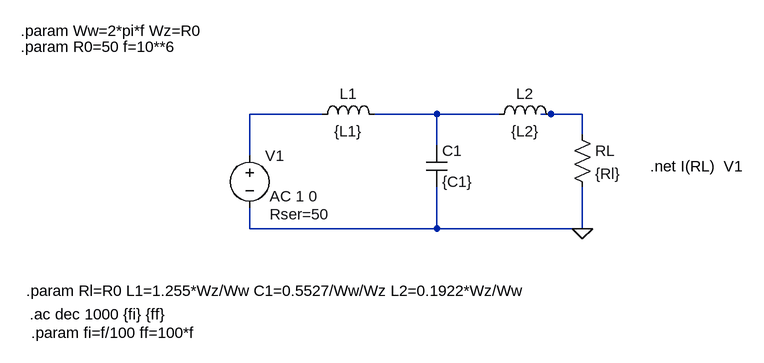
[diagram p0: schematic TS13.asc]
TS13.asc, the LTspice schematic file:
Version 4
SHEET 1 880 680
WIRE 176 96 64 96
WIRE 352 96 256 96
WIRE 448 96 352 96
WIRE 528 96 512 96
WIRE 576 96 528 96
WIRE 576 128 576 96
WIRE 352 144 352 96
WIRE 64 160 64 96
WIRE 64 272 64 240
WIRE 352 272 352 208
WIRE 352 272 64 272
WIRE 576 272 576 208
WIRE 576 272 352 272
FLAG 576 272 0
SYMBOL ind 160 112 R270
WINDOW 0 32 56 VTop 2
WINDOW 3 5 56 VBottom 2
SYMATTR InstName L1
SYMATTR Value {L1}
SYMBOL ind 432 112 R270
WINDOW 0 32 56 VTop 2
WINDOW 3 5 56 VBottom 2
SYMATTR InstName L2
SYMATTR Value {L2}
SYMBOL cap 336 144 R0
SYMATTR InstName C1
SYMATTR Value {C1}
SYMBOL res 560 112 R0
SYMATTR InstName RL
SYMATTR Value {Rl}
SYMBOL voltage 64 144 R0
WINDOW 123 31 78 Left 2
WINDOW 39 31 106 Left 2
SYMATTR InstName V1
SYMATTR Value ""
SYMATTR Value2 AC 1 0
SYMATTR SpiceLine Rser=50
TEXT -288 -32 Left 2 !.param Ww=2*pi*f Wz=R0
TEXT -280 368 Left 2 !.param Rl=R0 L1=1.255*Wz/Ww C1=0.5527/Ww/Wz L2=0.1922*Wz/Ww
TEXT 680 176 Left 2 !.net I(RL)  V1
TEXT -274 404 Left 2 !.ac dec 1000 {fi} {ff}
TEXT -288 -8 Left 2 !.param R0=50 f=10**6
TEXT -272 432 Left 2 !.param fi=f/100 ff=100*f

The netlist it stands for:
* TS13.asc
L1 N001 N002 {L1}
L2 N002 N003 {L2}
C1 N002 0 {C1}
RL N003 0 {Rl}
V1 N001 0 AC 1 0 Rser=50
.param Ww=2*pi*f Wz=R0
.param Rl=R0 L1=1.255*Wz/Ww C1=0.5527/Ww/Wz L2=0.1922*Wz/Ww
.net I(RL)  V1
.ac dec 1000 {fi} {ff}
.param R0=50 f=10**6
.param fi=f/100 ff=100*f
.backanno
.end